# EAGLE design filters (EAGLE 4.16)
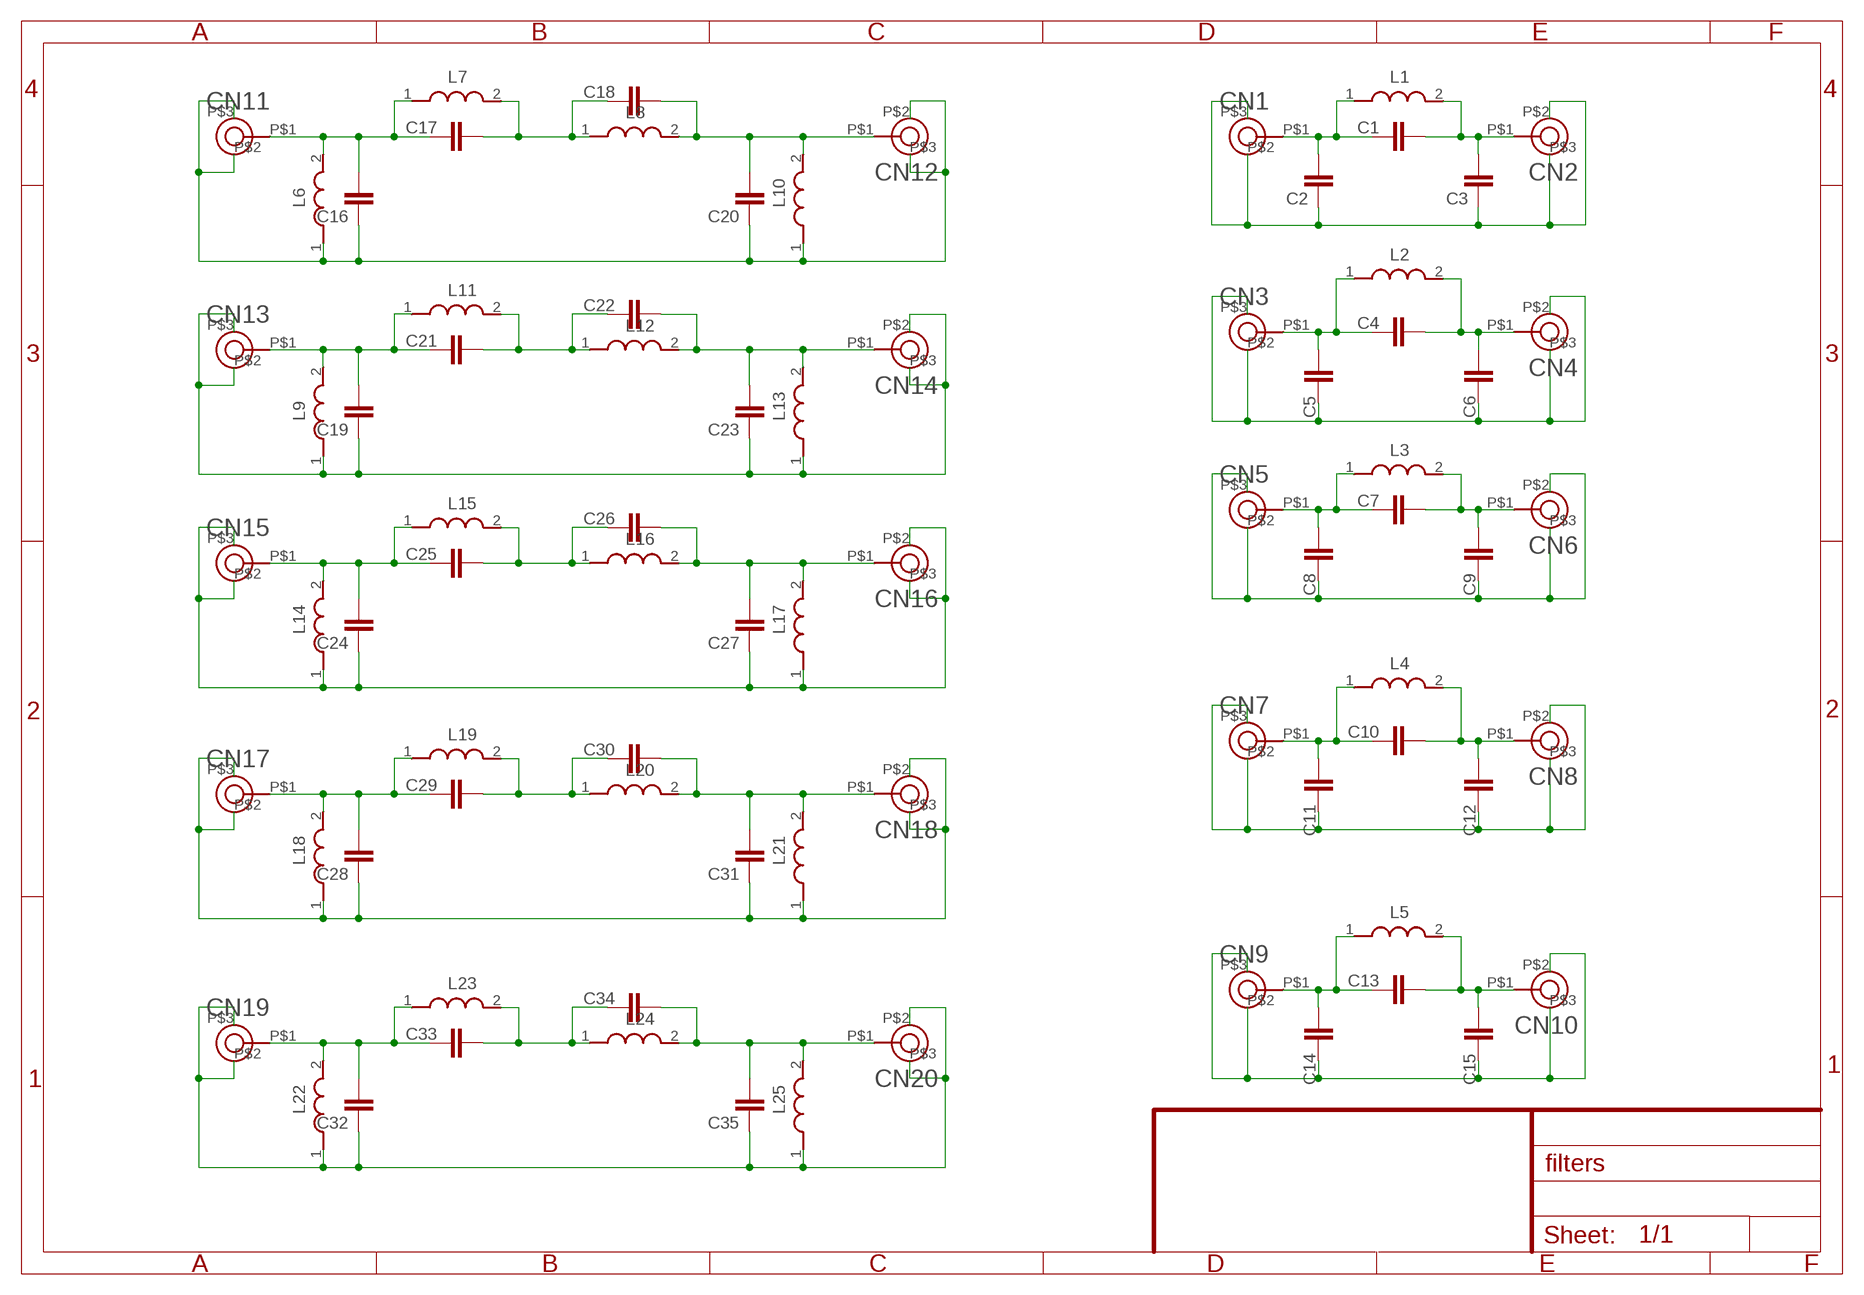
[diagram p0: schematic, sheet 1]

## Parts
C1  C1608  [1608]
C2  C1608  [1608]
C3  C1608  [1608]
C4  C1608  [1608]
C5  C1608  [1608]
C6  C1608  [1608]
C7  C1608  [1608]
C8  C1608  [1608]
C9  C1608  [1608]
C10  C1608  [1608]
C11  C1608  [1608]
C12  C1608  [1608]
C13  C1608  [1608]
C14  C1608  [1608]
C15  C1608  [1608]
C16  C1608  [1608]
C17  C1608  [1608]
C18  C1608  [1608]
C19  C1608  [1608]
C20  C1608  [1608]
C21  C1608  [1608]
C22  C1608  [1608]
C23  C1608  [1608]
C24  C1608  [1608]
C25  C1608  [1608]
C26  C1608  [1608]
C27  C1608  [1608]
C28  C1608  [1608]
C29  C1608  [1608]
C30  C1608  [1608]
C31  C1608  [1608]
C32  C1608  [1608]
C33  C1608  [1608]
C34  C1608  [1608]
C35  C1608  [1608]
CN1  U.FL-R-SMT  [U.FL-R-SMT]
CN2  U.FL-R-SMT  [U.FL-R-SMT]
CN3  U.FL-R-SMT  [U.FL-R-SMT]
CN4  U.FL-R-SMT  [U.FL-R-SMT]
CN5  U.FL-R-SMT  [U.FL-R-SMT]
CN6  U.FL-R-SMT  [U.FL-R-SMT]
CN7  U.FL-R-SMT  [U.FL-R-SMT]
CN8  U.FL-R-SMT  [U.FL-R-SMT]
CN9  U.FL-R-SMT  [U.FL-R-SMT]
CN10  U.FL-R-SMT  [U.FL-R-SMT]
CN11  U.FL-R-SMT  [U.FL-R-SMT]
CN12  U.FL-R-SMT  [U.FL-R-SMT]
CN13  U.FL-R-SMT  [U.FL-R-SMT]
CN14  U.FL-R-SMT  [U.FL-R-SMT]
CN15  U.FL-R-SMT  [U.FL-R-SMT]
CN16  U.FL-R-SMT  [U.FL-R-SMT]
CN17  U.FL-R-SMT  [U.FL-R-SMT]
CN18  U.FL-R-SMT  [U.FL-R-SMT]
CN19  U.FL-R-SMT  [U.FL-R-SMT]
CN20  U.FL-R-SMT  [U.FL-R-SMT]
L1  L  [1608]
L2  L  [1608]
L3  L  [1608]
L4  L  [1608]
L5  L  [1608]
L6  L  [1608]
L7  L  [1608]
L8  L  [1608]
L9  L  [1608]
L10  L  [1608]
L11  L  [1608]
L12  L  [1608]
L13  L  [1608]
L14  L  [1608]
L15  L  [1608]
L16  L  [1608]
L17  L  [1608]
L18  L  [1608]
L19  L  [1608]
L20  L  [1608]
L21  L  [1608]
L22  L  [1608]
L23  L  [1608]
L24  L  [1608]
L25  L  [1608]

## Nets
AGND: C2.1 C3.1 C5.1 C6.1 C8.1 C9.1 C11.1 C12.1 C14.1 C15.1 C16.1 C19.1 C20.1 C23.1 C24.1 C27.1 C28.1 C31.1 C32.1 C35.1 CN1.P$2(AGND) CN1.P$3(AGND2) CN2.P$2(AGND) CN2.P$3(AGND2) CN3.P$2(AGND) CN3.P$3(AGND2) CN4.P$2(AGND) CN4.P$3(AGND2) CN5.P$2(AGND) CN5.P$3(AGND2) CN6.P$2(AGND) CN6.P$3(AGND2) CN7.P$2(AGND) CN7.P$3(AGND2) CN8.P$2(AGND) CN8.P$3(AGND2) CN9.P$2(AGND) CN9.P$3(AGND2) CN10.P$2(AGND) CN10.P$3(AGND2) CN11.P$2(AGND) CN11.P$3(AGND2) CN12.P$2(AGND) CN12.P$3(AGND2) CN13.P$2(AGND) CN13.P$3(AGND2) CN14.P$2(AGND) CN14.P$3(AGND2) CN15.P$2(AGND) CN15.P$3(AGND2) CN16.P$2(AGND) CN16.P$3(AGND2) CN17.P$2(AGND) CN17.P$3(AGND2) CN18.P$2(AGND) CN18.P$3(AGND2) CN19.P$2(AGND) CN19.P$3(AGND2) CN20.P$2(AGND) CN20.P$3(AGND2) L6.1 L9.1 L10.1 L13.1 L14.1 L17.1 L18.1 L21.1 L22.1 L25.1
N$1: C1.1 C2.2 CN1.P$1 L1.1
N$2: C1.2 C3.2 CN2.P$1 L1.2
N$3: C4.1 C5.2 CN3.P$1 L2.1
N$4: C4.2 C6.2 CN4.P$1 L2.2
N$5: C7.1 C8.2 CN5.P$1 L3.1
N$6: C7.2 C9.2 CN6.P$1 L3.2
N$7: C10.1 C11.2 CN7.P$1 L4.1
N$8: C10.2 C12.2 CN8.P$1 L4.2
N$9: C13.1 C14.2 CN9.P$1 L5.1
N$10: C13.2 C15.2 CN10.P$1 L5.2
N$11: C16.2 C17.1 CN11.P$1 L6.2 L7.1
N$12: C17.2 C18.1 L7.2 L8.1
N$13: C18.2 C20.2 CN12.P$1 L8.2 L10.2
N$14: C19.2 C21.1 CN13.P$1 L9.2 L11.1
N$15: C21.2 C22.1 L11.2 L12.1
N$16: C22.2 C23.2 CN14.P$1 L12.2 L13.2
N$17: C24.2 C25.1 CN15.P$1 L14.2 L15.1
N$18: C25.2 C26.1 L15.2 L16.1
N$19: C26.2 C27.2 CN16.P$1 L16.2 L17.2
N$20: C28.2 C29.1 CN17.P$1 L18.2 L19.1
N$21: C29.2 C30.1 L19.2 L20.1
N$22: C30.2 C31.2 CN18.P$1 L20.2 L21.2
N$23: C32.2 C33.1 CN19.P$1 L22.2 L23.1
N$24: C33.2 C34.1 L23.2 L24.1
N$25: C34.2 C35.2 CN20.P$1 L24.2 L25.2

## Library data of the parts
C1-C35 = capacitor:C: CAPACITOR naming: grid - package width
CN1-CN20 = HIROSE:U.FL-R-SMT
L1-L25 = inductor:L

## Board
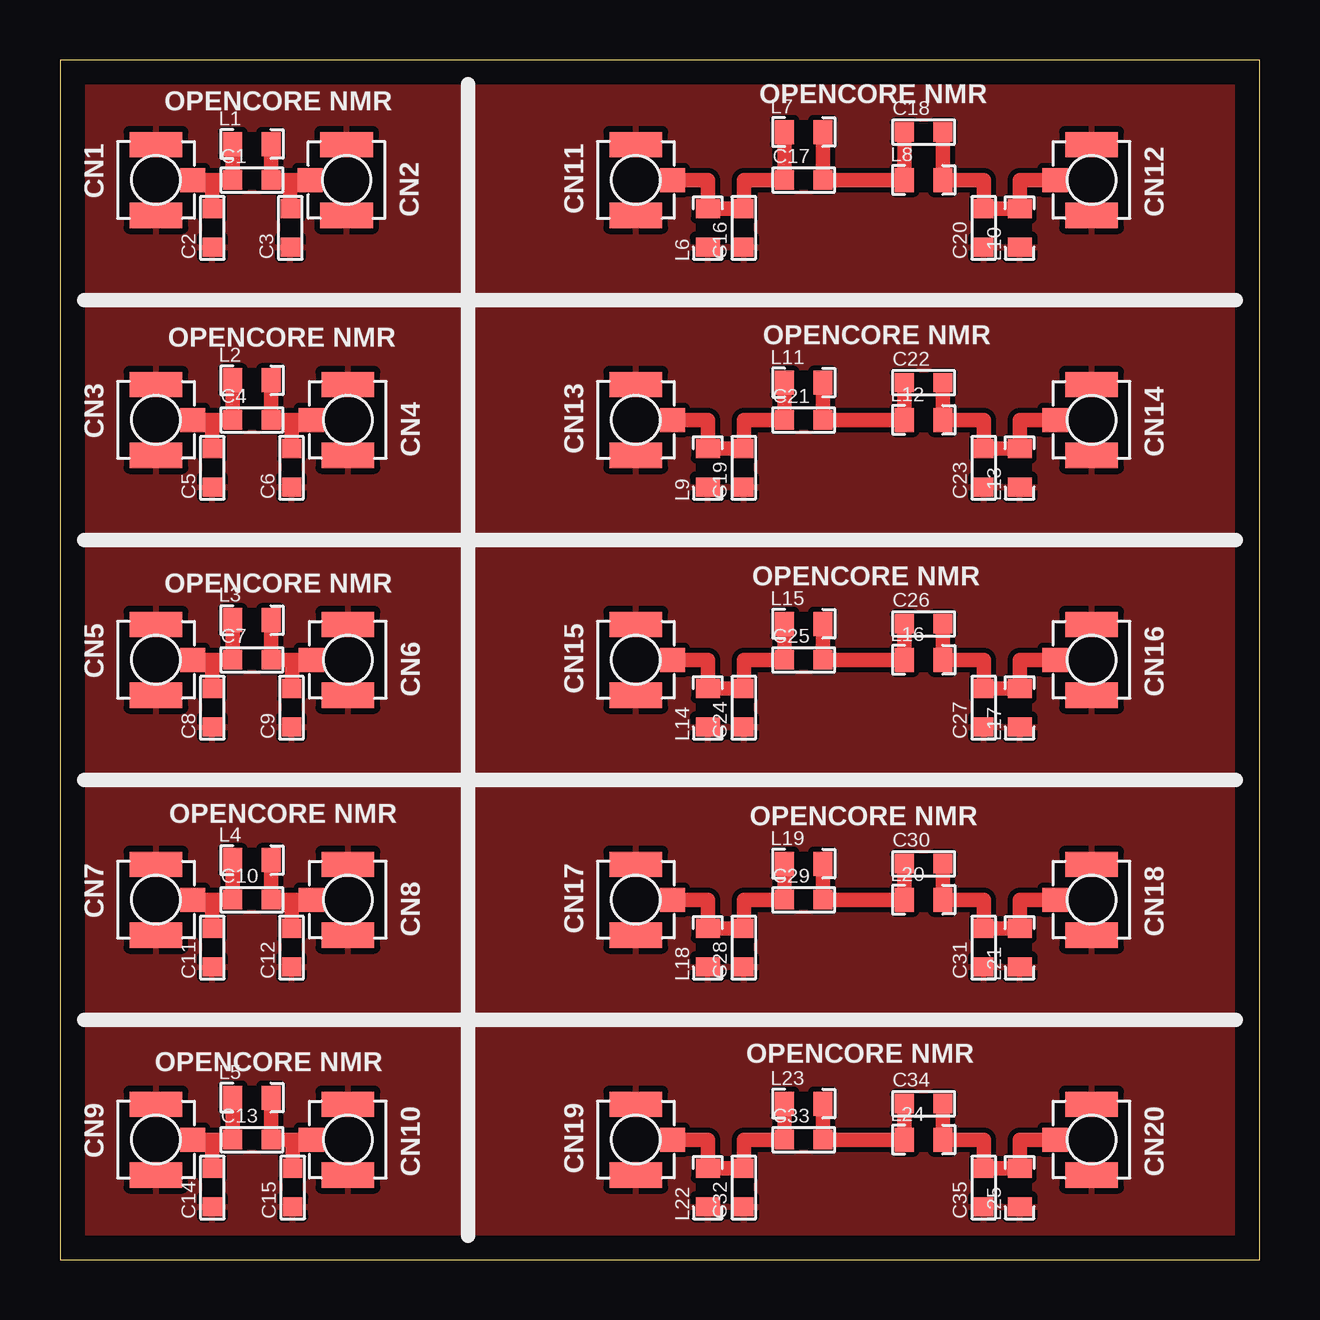
[diagram p1: board, top side]

Size 50 x 50 mm. Coordinates in mm from the lower left corner, seen from the top.
Outline: 0,0 50,0 50,50 0,50 0,0
Copper layers (1*16): Top 0.035mm / dielectric 1.5mm / Bottom 0.035mm
Design rules "default": minimum track width 10mil, minimum drill 24mil, track to track 8mil, track to pad 8mil, pad to pad 8mil, via to via 8mil, smd to smd 8mil, copper to edge 40mil, drill to drill 8mil, minimum pad ring 10mil, minimum via ring 8mil, stop-mask expansion 4mil, vias tented up to drill 0mil, thermal gap 10mil

### Footprints (pad centres in the part's own frame; a part is rotated, then mirrored left to right if it is on the bottom)
1608 = smd 0.8 x 0.8: 1 -0.8,0; 2 0.8,0
U.FL-R-SMT = smd 1 x 1.05: P$1 0,1.525 | smd 1.05 x 2.2: P$2 1.475,0; P$3 -1.475,0
1608' = smd 0.8 x 1: 1 -0.8,0; 2 0.8,0

### Placement (x,y rotation side)
C1  8,45 0 top
C2  6.35,43 90 top
C3  9.6,43 90 top
C4  8,35 0 top
C5  6.35,33 90 top
C6  9.65,33 90 top
C7  8,25 0 top
C8  6.35,23 90 top
C9  9.65,23 90 top
C10  8,15 0 top
C11  6.35,13 90 top
C12  9.65,13 90 top
C13  8,5 0 top
C14  6.35,3 90 top
C15  9.7,3 90 top
C16  28.5,43 90 top
C17  31,45 0 top
C18  36,47 0 top
C19  28.5,33 90 top
C20  38.5,43 90 top
C21  31,35 0 top
C22  36,36.55 0 top
C23  38.5,33 90 top
C24  28.5,23 90 top
C25  31,25 0 top
C26  36,26.5 0 top
C27  38.5,23 90 top
C28  28.5,13 90 top
C29  31,15 0 top
C30  36,16.5 0 top
C31  38.5,13 90 top
C32  28.5,3 90 top
C33  31,5 0 top
C34  36,6.5 0 top
C35  38.5,3 90 top
CN1  4,45 270 top
CN2  11.95,45 90 top
CN3  4,35 270 top
CN4  12,35 90 top
CN5  4,25 270 top
CN6  12,25 90 top
CN7  4,15 270 top
CN8  12,15 90 top
CN9  4,5 270 top
CN10  12,5 90 top
CN11  24,45 270 top
CN12  43,45 90 top
CN13  24,35 270 top
CN14  43,35 90 top
CN15  24,25 270 top
CN16  43,25 90 top
CN17  24,15 270 top
CN18  43,15 90 top
CN19  24,5 270 top
CN20  43,5 90 top
L1  [1608']  8,46.5 0 top
L2  [1608']  8,36.65 0 top
L3  [1608']  8,26.65 0 top
L4  [1608']  8,16.65 0 top
L5  [1608']  8,6.75 0 top
L6  [1608']  27,43 90 top
L7  [1608']  31,47 0 top
L8  [1608']  36,45 0 top
L9  [1608']  27,33 90 top
L10  [1608']  40,43 90 top
L11  [1608']  31,36.55 0 top
L12  [1608']  36,35 0 top
L13  [1608']  40,33 90 top
L14  [1608']  27,23 90 top
L15  [1608']  31,26.5 0 top
L16  [1608']  36,25 0 top
L17  [1608']  40,23 90 top
L18  [1608']  27,13 90 top
L19  [1608']  31,16.5 0 top
L20  [1608']  36,15 0 top
L21  [1608']  40,13 90 top
L22  [1608']  27,3 90 top
L23  [1608']  31,6.5 0 top
L24  [1608']  36,5 0 top
L25  [1608']  40,3 90 top

### Tracks (layer width: path | path; a pad name or v marks a point on that pad's centre or on a via)
AGND
  pour Top: 0,0 50,0 50,50 0,50
N$1
  Top 0.61: 6.35,45 CN1.P$1 | L1.1 C1.1 6.35,45 | C2.2 6.35,45
N$2
  Top 0.61: 9.6,45 CN2.P$1 | L1.2 C1.2 9.6,45 | C3.2 9.6,45
N$3
  Top 0.61: 6.35,35 CN3.P$1 | L2.1 C4.1 6.35,35 | C5.2 6.35,35
N$4
  Top 0.61: 9.65,35 CN4.P$1 | L2.2 C4.2 9.65,35 | C6.2 9.65,35
N$5
  Top 0.61: L3.1 C7.1 6.35,25 | 6.35,25 CN5.P$1 | C8.2 6.35,25
N$6
  Top 0.61: L3.2 C7.2 9.7,25 | 9.7,25 CN6.P$1 | C9.2 9.7,25
N$7
  Top 0.61: L4.1 C10.1 6.35,15 | 6.35,15 CN7.P$1 | C11.2 6.35,15
N$8
  Top 0.61: L4.2 C10.2 9.65,15 | 9.65,15 CN8.P$1 | C12.2 9.65,15
N$9
  Top 0.61: 6.35,5 CN9.P$1 | L5.1 C13.1 6.35,5 | C14.2 6.35,5
N$10
  Top 0.61: 9.7,5 CN10.P$1 | L5.2 C13.2 9.7,5 | C15.2 9.7,5
N$11
  Top 0.61: CN11.P$1 27,45 L6.2 C16.2 28.5,45 C17.1 L7.1
N$12
  Top 0.61: L7.2 C17.2 L8.1 C18.1
N$13
  Top 0.61: C18.2 L8.2 38.5,45 C20.2 L10.2 40,45 CN12.P$1
N$14
  Top 0.61: CN13.P$1 27,35 L9.2 C19.2 28.5,35 C21.1 L11.1
N$15
  Top 0.61: L11.2 C21.2 L12.1 C22.1
N$16
  Top 0.61: C22.2 L12.2 38.5,35 C23.2 L13.2 40,35 CN14.P$1
N$17
  Top 0.61: CN15.P$1 27,25 L14.2 C24.2 28.5,25 C25.1 L15.1
N$18
  Top 0.61: L15.2 C25.2 L16.1 C26.1
N$19
  Top 0.61: C26.2 L16.2 38.5,25 C27.2 L17.2 40,25 CN16.P$1
N$20
  Top 0.61: CN17.P$1 27,15 L18.2 C28.2 28.5,15 C29.1 L19.1
N$21
  Top 0.61: L19.2 C29.2 L20.1 C30.1
N$22
  Top 0.61: C30.2 L20.2 38.5,15 C31.2 L21.2 40,15 CN18.P$1
N$23
  Top 0.61: CN19.P$1 27,5 L22.2 C32.2 28.5,5 C33.1 L23.1
N$24
  Top 0.61: L23.2 C33.2 L24.1 C34.1
N$25
  Top 0.61: C34.2 L24.2 38.5,5 C35.2 L25.2 40,5 CN20.P$1

### Text on the board
tPlace: OPENCORE NMR | OPENCORE NMR | OPENCORE NMR | OPENCORE NMR | OPENCORE NMR | OPENCORE NMR | OPENCORE NMR | OPENCORE NMR | OPENCORE NMR | OPENCORE NMR